# EAGLE design eCog_UART_Template (EAGLE 6.6.0)
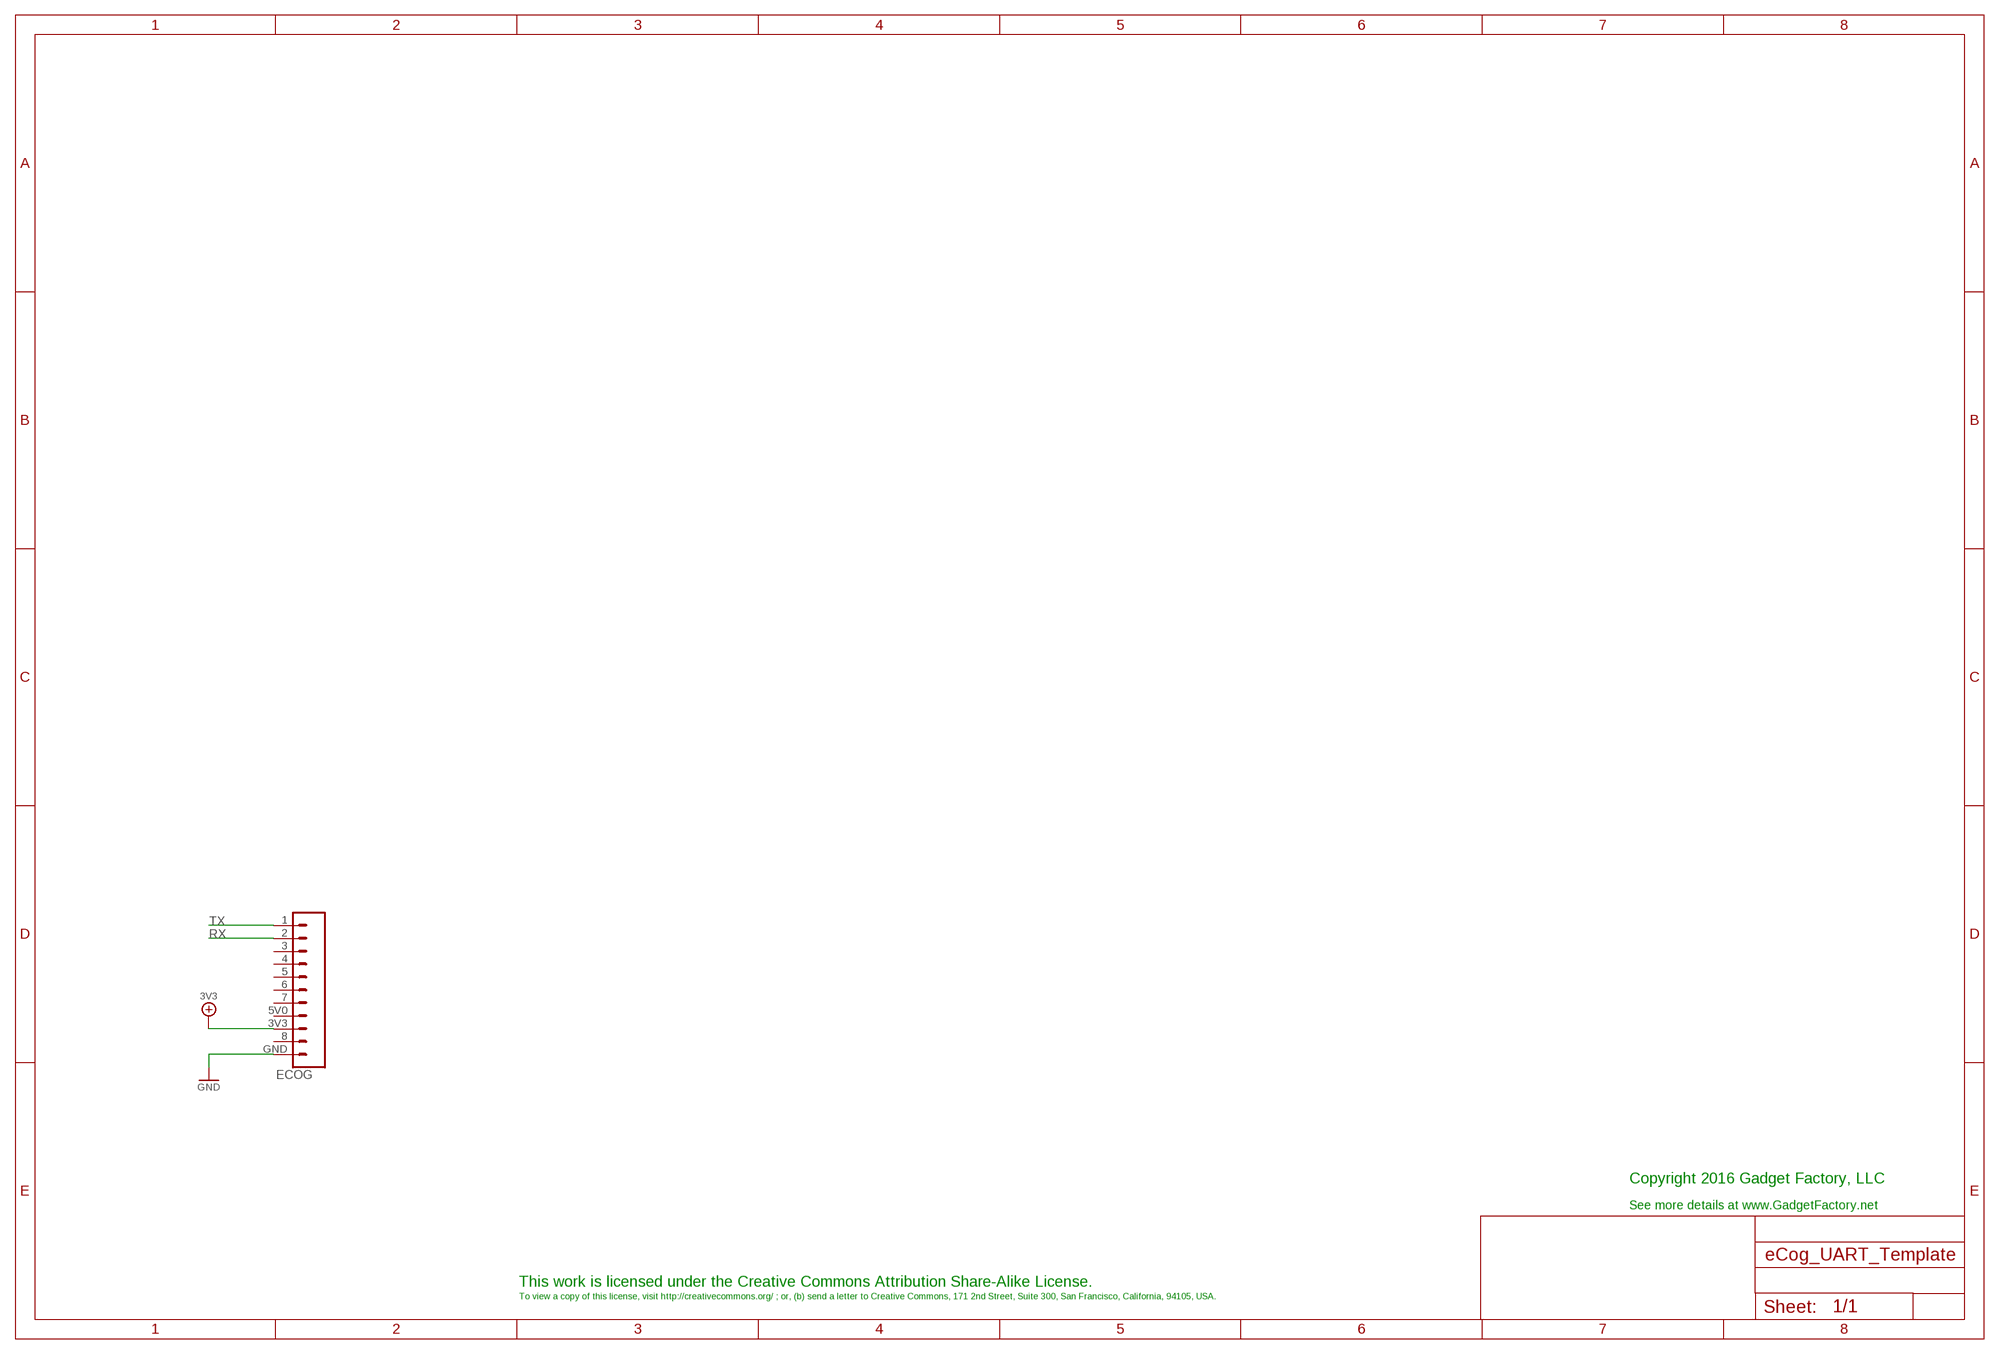
[diagram p0: schematic, sheet 1]

## Parts
ECOG  ECOG_GENERAL_ROWECOG_GENERAL_SMD  [ECOG_GENERAL_SMD]

## Nets
3V3: ECOG.3V3
GND: ECOG.GND
RX: ECOG.2(G1)
TX: ECOG.1(G0)
Unconnected: ECOG.3(G2) ECOG.4(G3) ECOG.5(G4) ECOG.5V0(5V) ECOG.6(G5) ECOG.7(G6) ECOG.8(G7)

## Notes on the sheet
- Copyright 2016 Gadget Factory, LLC
- See more details at www.GadgetFactory.net
- This work is licensed under the Creative Commons Attribution Share-Alike License.
- To view a copy of this license, visit http://creativecommons.org/ ; or, (b) send a letter to Creative Commons, 171 2nd Street, Suite 300, San Francisco, California, 94105, USA.

## Library data of the parts
ECOG = eCogs:ECOG_GENERAL_ROW

## Board
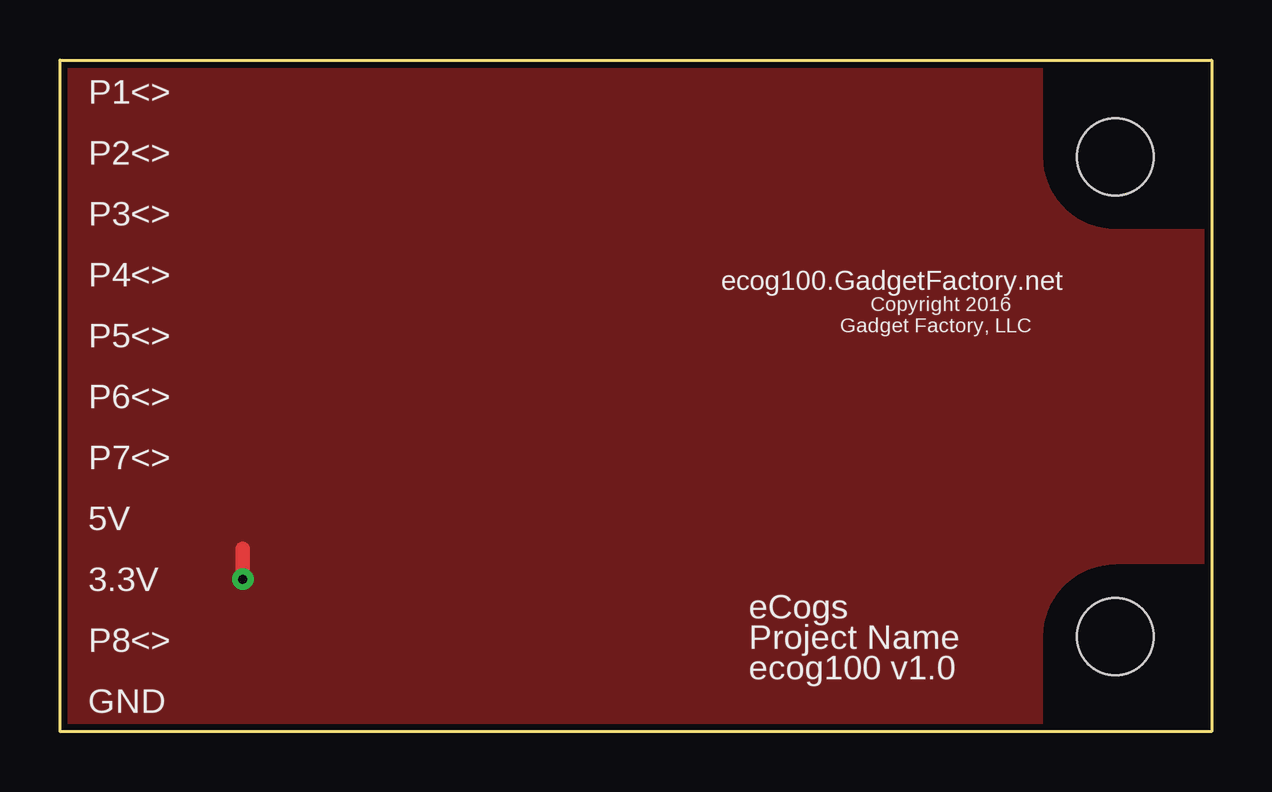
[diagram p1: board, top side]
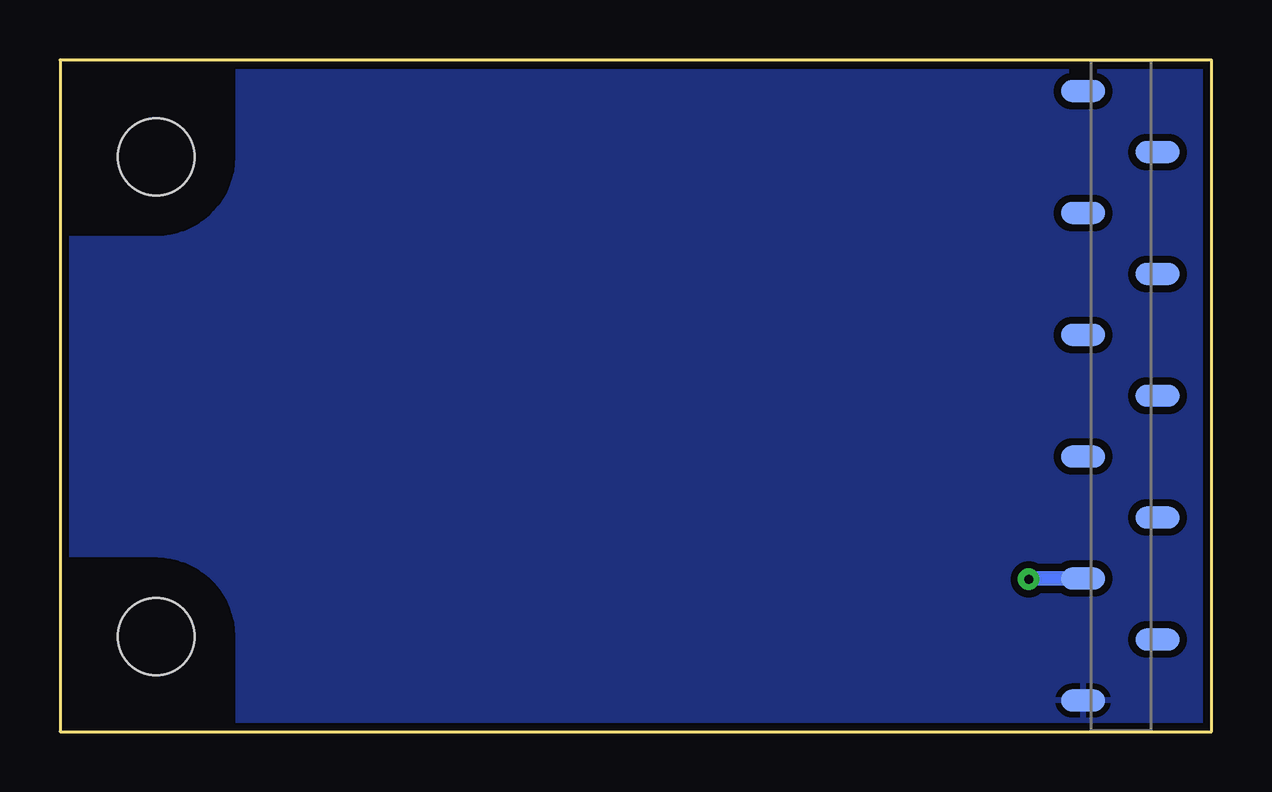
[diagram p2: board, bottom side, seen from below]

Size 48 x 28 mm. Coordinates in mm from the lower left corner, seen from the top.
Outline: 0,0 48,0 48,28 0,28 0,0
Copper layers (1*16): Top 0.035mm / dielectric 1.5mm / Bottom 0.035mm
Design rules "SparkFun": minimum track width 8mil, minimum drill 20mil, track to track 8mil, track to pad 8mil, pad to pad 8mil, via to via 8mil, smd to smd 8mil, copper to edge 10mil, drill to drill 8mil, minimum pad ring 12mil, minimum via ring 10mil, stop-mask expansion 4mil, vias tented up to drill 25mil, thermal gap 10mil

### Footprints (pad centres in the part's own frame; a part is rotated, then mirrored left to right if it is on the bottom)
ECOG_GENERAL_SMD = smd 1.841 x 0.914 bottom: 1 5.349,26.7; 2 2.251,24.16; 3 5.349,21.62; 3V3 5.349,6.38; 4 2.251,19.08; 5 5.349,16.54; 5V0 2.251,8.92; 6 2.251,14; 7 5.349,11.46; 8 2.251,3.84; GND 5.349,1.3 | hole 3.2: 43.99,3.96; 43.99,23.96

### Placement (x,y rotation side)
ECOG  0,0 0 top

### Tracks (layer width: path | path; a pad name or v marks a point on that pad's centre or on a via)
3V3  (via drill 0.38)
  Top 0.61: v7.62,6.35 7.62,7.62
  Bottom 0.61: ECOG.3V3 7.59,6.38 v7.62,6.35
  pour Top: 0,28 48,28 48,0 0,0
GND
  pour Bottom (isolate 0.305): 0,28 48,28 48,0 0,0

### Text on the board
tPlace: P1<> | P2<> | P3<> | P4<> | ecog100.GadgetFactory.net | Copyright 2016 | Gadget Factory, LLC | P5<> | P6<> | P7<> | 5V | 3.3V | eCogs | P8<> | Project Name | ecog100 v1.0 | GND